# EAGLE design Transmitter (EAGLE 8.2.1)
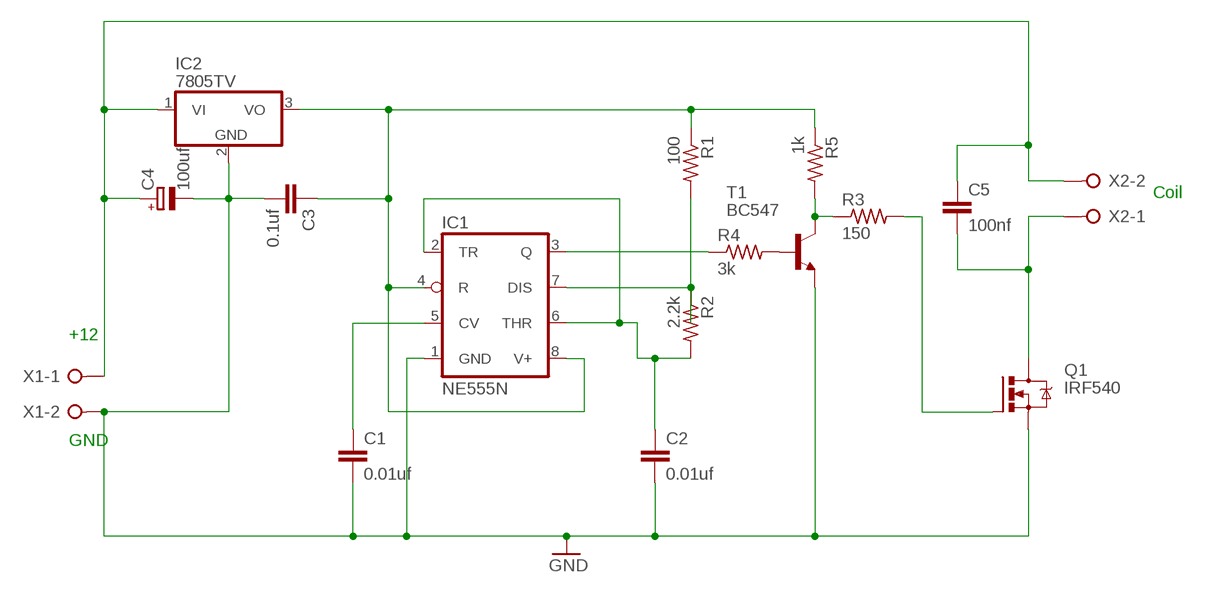
[diagram p0: schematic, sheet 1]

## Parts
C1  0.01uf  C-EU025-030X050  [C025-030X050]
C2  0.01uf  C-EU025-030X050  [C025-030X050]
C3  0.1uf  C-EU025-030X050  [C025-030X050]
C4  100uf  CPOL-EUE2,5-6E  [E2,5-6E]
C5  100nf  C-EU102-064X133  [C102-064X133]
IC1  NE555N  [DIL08]
IC2  7805TV  [TO220V]
Q1  IRF540  [TO220BV]
R1  100  R-US_0207/10  [0207/10]
R2  2.2k  R-US_0207/10  [0207/10]
R3  150  R-US_0207/10  [0207/10]
R4  3k  R-US_0207/10  [0207/10]
R5  1k  R-US_0207/10  [0207/10]
T1  BC547  [TO92]
X1  W237-02P  [W237-132]
X2  W237-02P  [W237-132]

## Nets
GND: C1.2 C2.2 C3.2 C4.- IC1.1(GND) IC2.2(GND) Q1.S T1.1(E) X1.2
N$1: C4.+ C5.1 IC2.1(VI) X1.1 X2.2
N$2: C3.1 IC1.4(R) IC1.8(V+) IC2.3(VO) R1.1 R5.1
N$3: R4.2 T1.2(B)
N$4: IC1.7(DIS) R1.2 R2.1
N$5: C2.1 IC1.2(TR) IC1.6(THR) R2.2
N$6: R3.1 R5.2 T1.3(C)
N$8: C1.1 IC1.5(CV)
N$9: IC1.3(Q) R4.1
N$10: Q1.G R3.2
N$11: C5.2 Q1.D X2.1

## Notes on the sheet
- Coil
- +12
- GND

## Library data of the parts
C1-C3 C5 = rcl:C-EU: CAPACITOR, European symbol
C4 = rcl:CPOL-EU: POLARIZED CAPACITOR, European symbol
IC1 = linear:*555: TIMER
IC2 = linear:78*: Positive VOLTAGE REGULATOR Source: http://cache.national.com/ds/LM/LM78L05.pdf http://www.fairchildsemi.com/ds/LM/LM7805.pdf
Q1 = transistor-power:IRF540: HEXFET Power MOSFET
R1-R5 = rcl:R-US_: RESISTOR, American symbol
T1 = transistor:BC547: NPN TRANSISTOR
X1 X2 = con-wago-508:W237-02P: WAGO SREW CLAMP; OC_FARNELL: unknown; OC_NEWARK: unknown

## Board
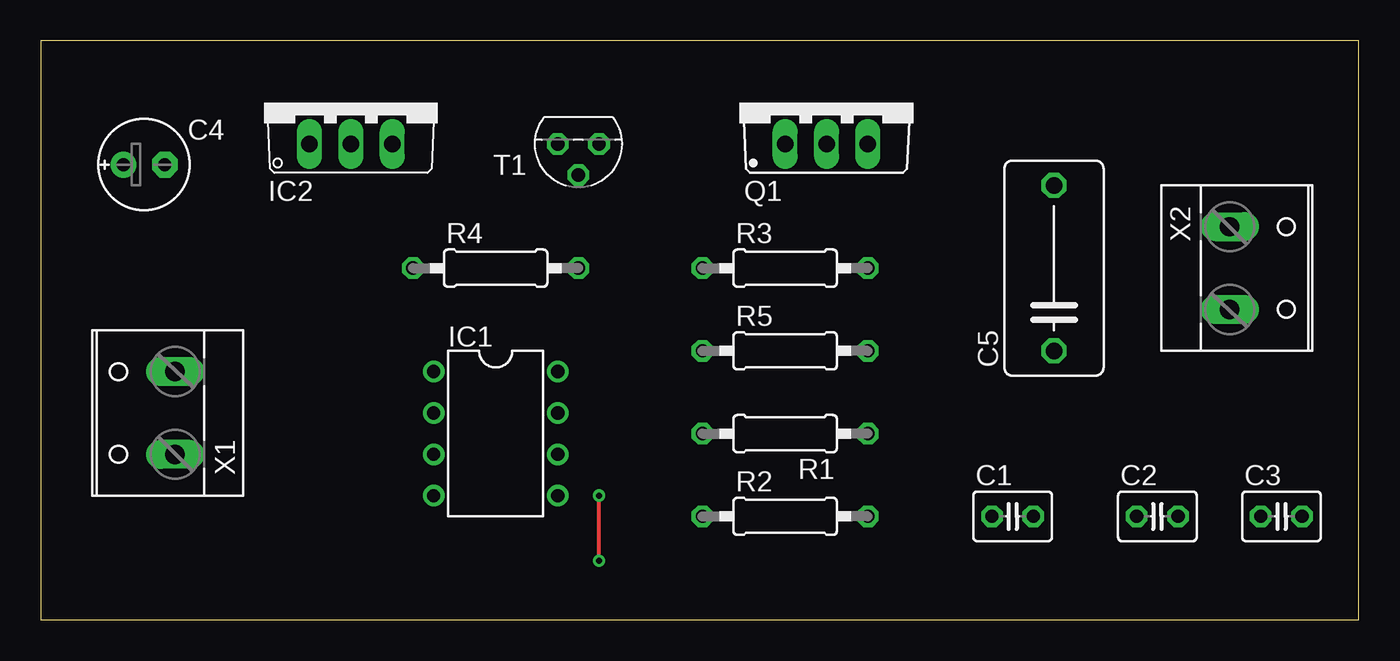
[diagram p1: board, top side]
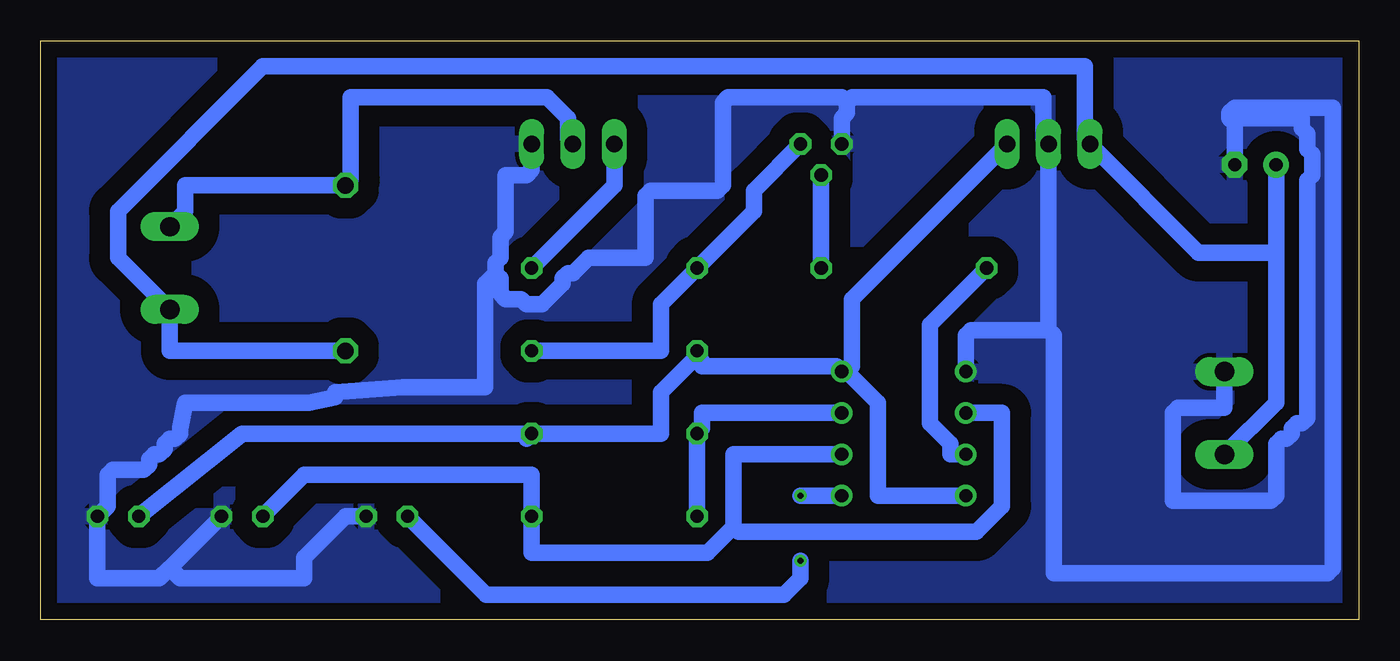
[diagram p2: board, bottom side, seen from below]

Size 80.95 x 35.55 mm. Coordinates in mm from the lower left corner, seen from the top.
Outline: 0,0 80.95,0 80.95,35.55 0,35.55 0,0
Copper layers (1*16): Top 0.035mm / dielectric 1.5mm / Bottom 0.035mm
Design rules "default *": minimum track width 40mil, minimum drill 0.35mm, track to track 50mil, track to pad 30mil, pad to pad 6mil, via to via 6mil, smd to smd 6mil, copper to edge 40mil, drill to drill 6mil, minimum pad ring 10mil, minimum via ring 8mil, stop-mask expansion 4mil, vias tented up to drill 0mil, thermal gap 10mil

### Footprints (pad centres in the part's own frame; a part is rotated, then mirrored left to right if it is on the bottom)
C025-030X050 = drill 0.813 octagon: 1 -1.27,0; 2 1.27,0
E2,5-6E = drill 0.813 pad 1.575: + -1.27,0 | drill 0.813 pad 1.575 octagon: - 1.27,0
C102-064X133 = drill 1.016 octagon: 1 -5.08,0; 2 5.08,0
DIL08 = drill 0.813 pad 1.27: 1 -3.81,-3.81; 2 -1.27,-3.81; 3 1.27,-3.81; 4 3.81,-3.81; 5 3.81,3.81; 6 1.27,3.81; 7 -1.27,3.81; 8 -3.81,3.81
TO220V = drill 1.016 long: 1 -2.54,-2.54; 2 0,-2.54; 3 2.54,-2.54
TO220BV = drill 1.016 long: D 0,-2.54; G -2.54,-2.54; S 2.54,-2.54
0207/10 = drill 0.813 octagon: 1 -5.08,0; 2 5.08,0
TO92 = drill 0.813 octagon: 1 1.27,0; 2 0,1.905; 3 -1.27,0
W237-132 = drill 1.194 long: 1 -2.54,-0.635; 2 2.54,-0.635

### Placement (x,y rotation side)
C1  59.69,6.35 0 top
C2  68.58,6.35 0 top
C3  76.2,6.35 0 top
C4  6.35,27.94 0 top
C5  62.23,21.59 90 top
IC1  27.94,11.43 270 top
IC2  19.05,31.75 0 top
Q1  48.26,31.75 0 top
R1  45.72,11.43 180 top
R2  45.72,6.35 0 top
R3  45.72,21.59 0 top
R4  27.94,21.59 0 top
R5  45.72,16.51 0 top
T1  33.02,29.21 180 top
X1  7.62,12.7 90 top
X2  73.66,21.59 270 top

### Tracks (layer width: path | path; a pad name or v marks a point on that pad's centre or on a via)
GND
  Bottom 1.016: 7.62,30.48 C4.- | 7.62,30.48 7.3,30.8 3.49,30.8 3.49,30.16 3.17,29.84 3.17,28.89 2.86,28.57 2.86,27.3 3.17,26.99 3.17,12.38 3.49,12.06 3.81,12.06 4.13,11.75 4.13,11.43 4.45,11.11 4.76,11.11 5.08,10.79 5.08,7.62 5.4,7.3 11.43,7.3 11.43,12.7 11.11,13.02 8.26,13.02 X1.2 | IC1.1 24.13,17.46 23.81,17.78 19.05,17.78 | 19.05,17.78 IC2.2 19.37,29.53 19.37,32.07 31.11,32.07 31.43,31.75 | T1.1 31.75,30.8 31.43,31.11 31.43,31.75 | Q1.S 50.8,27.62 51.12,27.3 52.39,27.3 52.39,23.81 52.7,23.5 52.7,22.22 53.02,21.91 53.02,21.27 | 53.02,21.27 52.7,20.95 52.7,20 52.39,19.68 51.44,19.68 51.12,19.37 50.16,19.37 48.9,20.64 48.9,20.95 48.58,21.27 48.26,21.27 47.31,22.22 43.81,22.22 43.81,26.04 43.5,26.35 39.37,26.35 39.05,26.67 39.05,31.75 38.73,32.07 31.75,32.07 31.43,31.75 | 53.02,21.27 53.66,20.64 53.66,14.29 58.74,14.29 62.87,13.97 62.87,13.65 64.45,13.33 72.07,13.33 72.39,11.75 72.39,11.43 72.71,11.11 73.03,11.11 73.34,10.79 73.34,10.48 73.66,10.16 73.98,10.16 74.3,9.84 74.3,9.53 74.61,9.21 76.52,9.21 76.83,8.89 76.83,6.98 C3.2 77.47,2.54 73.66,2.54 73.03,3.17 | 7.62,30.48 7.94,30.8 7.94,31.11 7.62,31.43 1.59,31.43 1.59,3.17 1.91,2.86 18.73,2.86 18.73,17.46 19.05,17.78 | 73.03,3.17 C2.2 | C1.2 62.23,6.35 64.77,3.81 64.77,2.54 72.39,2.54 73.03,3.17
  pour Bottom: 0,35.56 81.28,35.56 81.28,0 0,0
N$1
  Bottom 1.016: C5.1 73.03,16.51 X2.2 76.2,22.22 76.2,25.08 67.31,33.97 16.83,33.97 16.83,29.53 IC2.1 9.84,22.54 5.08,22.54 | C4.+ 5.08,22.54 | X1.1 5.08,13.33 5.08,22.54
N$2
  Bottom 1.016: IC1.4 29.53,7.62 29.53,13.33 31.43,15.24 | 31.43,15.24 IC1.8 32.07,15.56 40.32,15.56 40.32,15.88 40.64,16.19 | IC2.3 31.11,19.68 31.11,15.56 31.43,15.24 | 40.64,16.19 42.86,13.97 42.86,11.43 R1.1 51.12,11.11 51.12,11.43 68.58,11.43 C3.1 | R5.1 40.64,16.19
N$3
  Bottom 1.016: T1.2 R4.2
N$4
  Bottom 1.016: R2.1 R1.2 40.32,11.75 40.32,12.7 IC1.7
N$5
  Bottom 1.016: IC1.6 38.42,10.16 38.42,5.71 | 38.42,5.71 40.01,4.13 50.8,4.13 R2.2 50.8,8.89 64.77,8.89 C2.1 | IC1.2 21.91,12.7 21.91,6.98 23.5,5.4 38.1,5.4 38.42,5.71
N$6
  Bottom 1.016: R5.2 42.86,16.51 42.86,19.37 R3.1 37.15,25.08 37.15,26.35 T1.3
N$8  (via drill 0.35)
  Top 0.254: v34.29,3.62 v34.29,7.62
  Bottom 0.254: v34.29,3.62 34.29,4
  Bottom 1.016: C1.1 53.59,1.52 35.31,1.52 34.29,2.54 v34.29,3.62 | v34.29,7.62 IC1.5
N$9
  Bottom 1.016: IC1.3 25.08,10.16 25.08,10.79 26.35,12.06 26.35,18.1 R4.1
N$10
  Bottom 1.016: R3.2 45.72,26.67 Q1.G
N$11
  Bottom 1.016: X2.1 72.07,25.08 72.07,26.67 C5.2 61.91,26.99 61.91,32.07 49.85,32.07 48.58,30.8 48.58,29.53 Q1.D